# EAGLE design BT AQ DOL R9 (EAGLE 9.6.2)

## Sheet 1 of 2
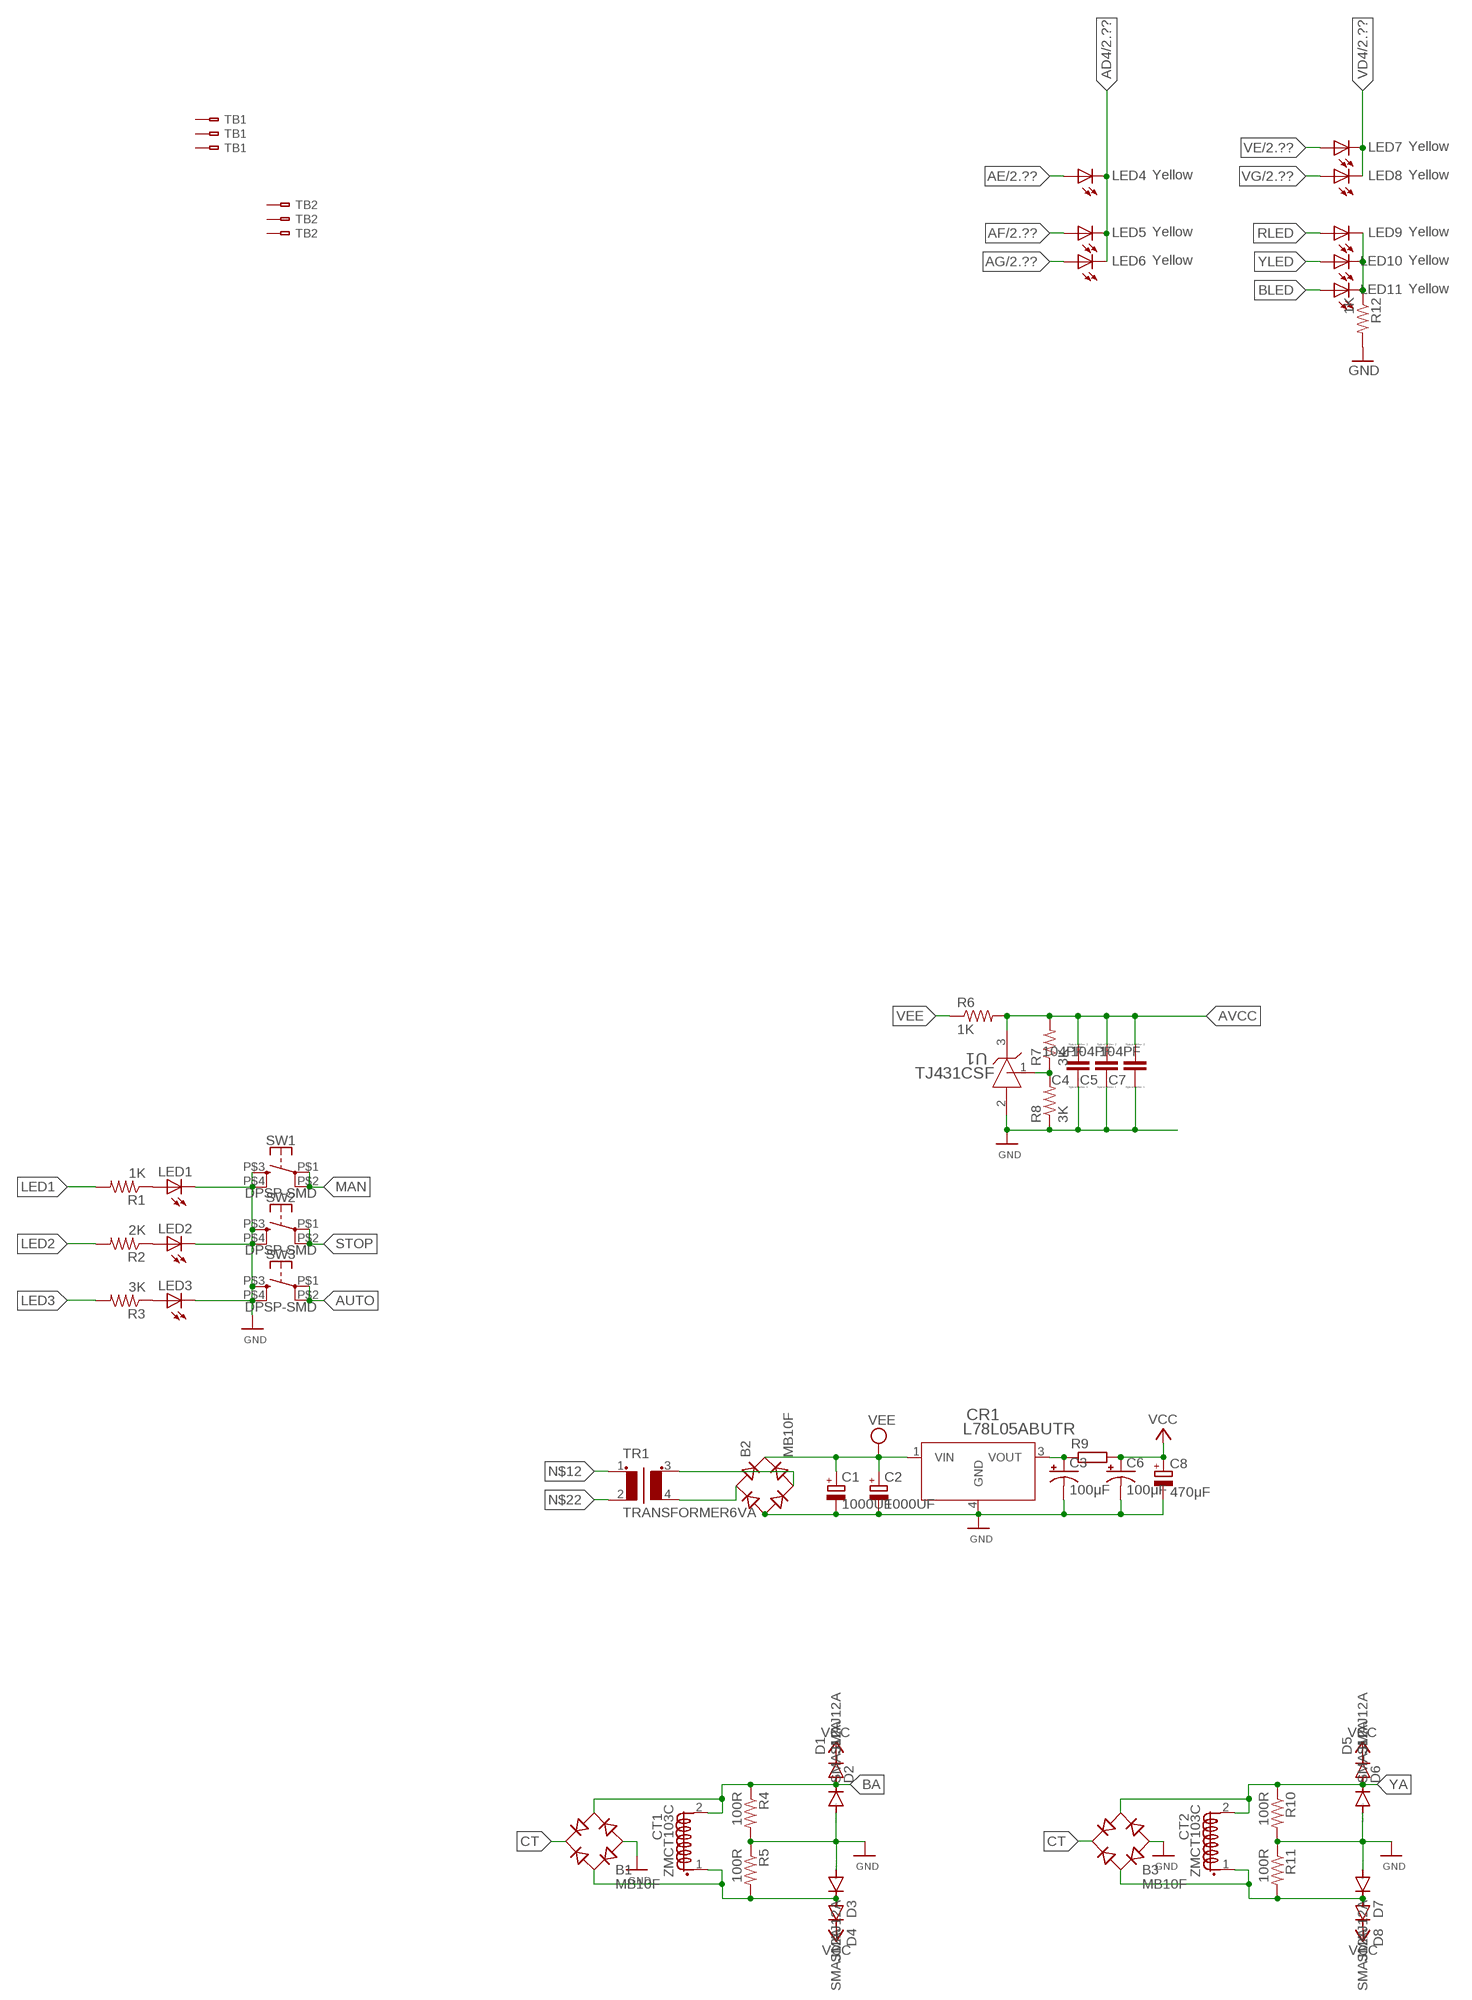
[diagram p0: schematic, sheet 1, part 1 of 3]
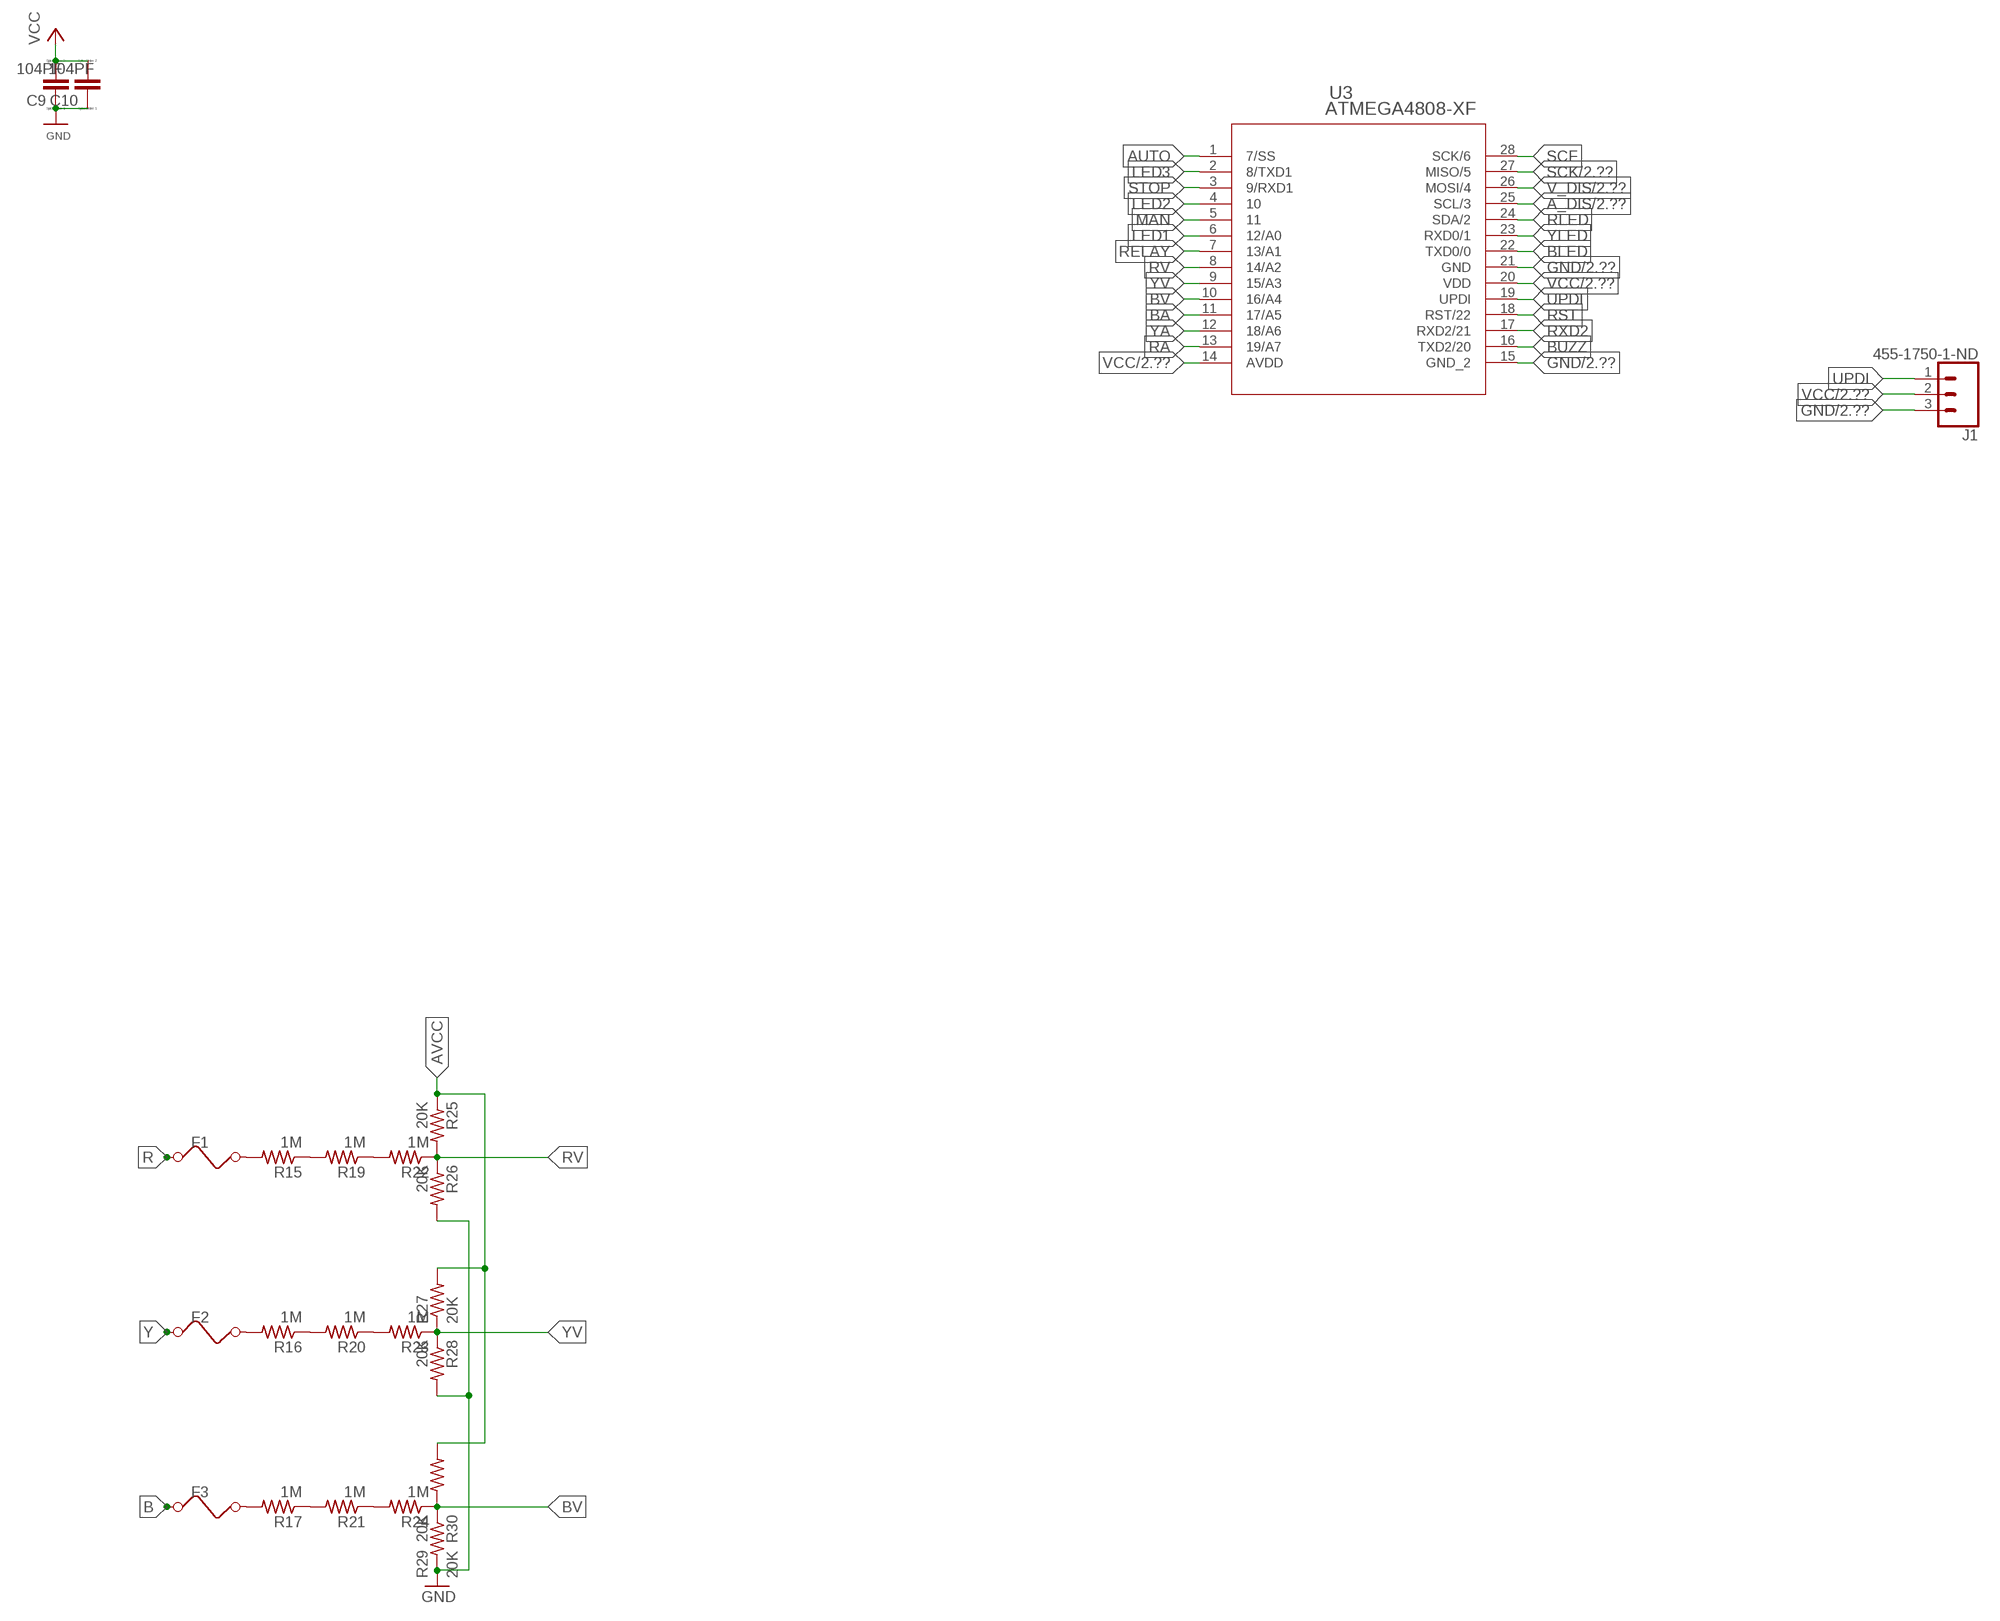
[diagram p1: schematic, sheet 1, part 2 of 3]
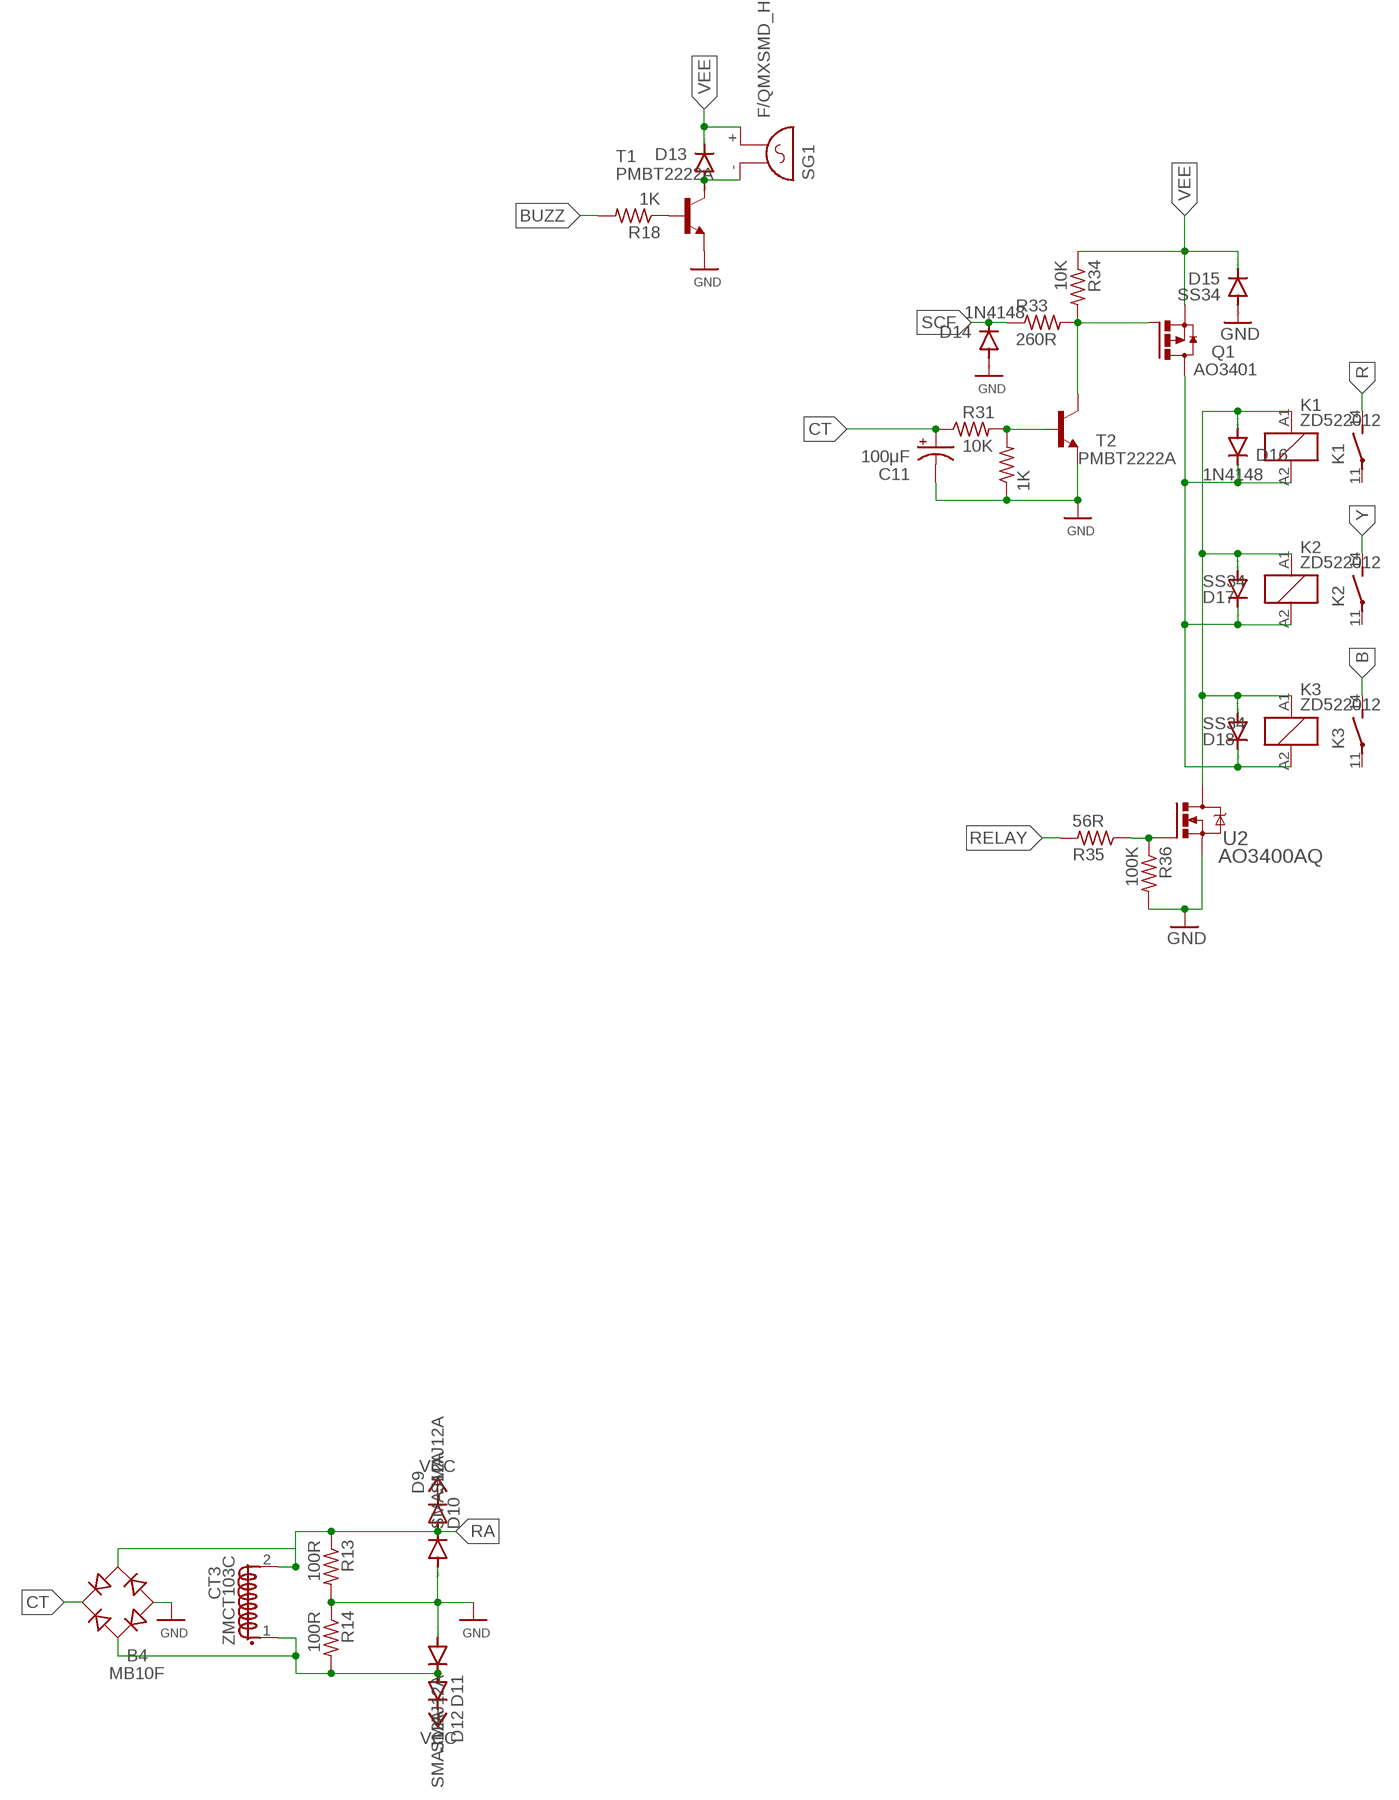
[diagram p2: schematic, sheet 1, part 3 of 3]

### Parts
B1  MB10F  MB8S  [SOIC-4]
B2  MB10F  MB8S  [SOIC-4]
B3  MB10F  MB8S  [SOIC-4]
B4  MB10F  MB8S  [SOIC-4]
C1  1000UF  CPOL-EUSANYO_G  [SANYO-OSCON_G]
C2  1000UF  CPOL-EUSANYO_G  [SANYO-OSCON_G]
C3  100μF  CPOL-USE2.5-6  [E2,5-6]
C4  104PF  CC1206  [C1206]
C5  104PF  CC1206  [C1206]
C6  100μF  CPOL-USE2.5-6  [E2,5-6]
C7  104PF  CC1206  [C1206]
C8  470μF  CPOL-EUE3.5-8  [E3,5-8]
C9  104PF  CC1206  [C1206]
C10  104PF  CC1206  [C1206]
C11  100μF  CPOL-USE2.5-6  [E2,5-6]
CR1  L78L05ABUTR  [D2PAK]
CT1  ZMCT103C  CT18X10  [ZMCT103C]
CT2  ZMCT103C  CT18X10  [ZMCT103C]
CT3  ZMCT103C  CT18X10  [ZMCT103C]
D1  SMAJ12A  DIODE-DO214AC  [DO214AC]
D2  SMAJ12A  DIODE-DO214AC  [DO214AC]
D3  SMAJ12A  DIODE-DO214AC  [DO214AC]
D4  SMAJ12A  DIODE-DO214AC  [DO214AC]
D5  SMAJ12A  DIODE-DO214AC  [DO214AC]
D6  SMAJ12A  DIODE-DO214AC  [DO214AC]
D7  SMAJ12A  DIODE-DO214AC  [DO214AC]
D8  SMAJ12A  DIODE-DO214AC  [DO214AC]
D9  SMAJ12A  DIODE-DO214AC  [DO214AC]
D10  SMAJ12A  DIODE-DO214AC  [DO214AC]
D11  SMAJ12A  DIODE-DO214AC  [DO214AC]
D12  SMAJ12A  DIODE-DO214AC  [DO214AC]
D13  1N4148  DIODE-MINIMELF  [MINIMELF]
D14  1N4148  DIODE-MINIMELF  [MINIMELF]
D15  SS34  DIODE-DO214AC  [DO214AC]
D16  1N4148  DIODE-MINIMELF  [MINIMELF]
D17  SS34  DIODE-DO214AC  [DO214AC]
D18  SS34  DIODE-DO214AC  [DO214AC]
F1  FUSESMD  [WIRE]
F2  FUSESMD  [WIRE]
F3  FUSESMD  [WIRE]
J1  455-1750-1-ND  CONN_03  [1X03]
K1  ZD522012  [ZD2F]
K2  ZD522012  [ZD2F]
K3  ZD522012  [ZD2F]
LED1  Blue  LED3MM  [LED3MM]
LED2  Blue  LED3MM  [LED3MM]
LED3  Blue  LED3MM  [LED3MM]
LED4  Yellow  LED3MM  [LED3MM]
LED5  Yellow  LED3MM  [LED3MM]
LED6  Yellow  LED3MM  [LED3MM]
LED7  Yellow  LED3MM  [LED3MM]
LED8  Yellow  LED3MM  [LED3MM]
LED9  Yellow  LED3MM  [LED3MM]
LED10  Yellow  LED3MM  [LED3MM]
LED11  Yellow  LED3MM  [LED3MM]
Q1  AO3401  FDN360P  [SUPER-SOT3]
R1  1K  R-US_M1206  [M1206]
R2  2K  R-US_M1206  [M1206]
R3  3K  R-US_M1206  [M1206]
R4  100R  R-US_M1206  [M1206]
R5  100R  R-US_M1206  [M1206]
R6  1K  R-US_M1206  [M1206]
R7  3K  R-US_M1206  [M1206]
R8  3K  R-US_M1206  [M1206]
R9  R-EU_R0603  [R0603]
R10  100R  R-US_M1206  [M1206]
R11  100R  R-US_M1206  [M1206]
R12  1K  R-US_M1206  [M1206]
R13  100R  R-US_M1206  [M1206]
R14  100R  R-US_M1206  [M1206]
R15  1M  R-US_M1206  [M1206]
R16  1M  R-US_M1206  [M1206]
R17  1M  R-US_M1206  [M1206]
R18  1K  R-US_M1206  [M1206]
R19  1M  R-US_M1206  [M1206]
R20  1M  R-US_M1206  [M1206]
R21  1M  R-US_M1206  [M1206]
R22  1M  R-US_M1206  [M1206]
R23  1M  R-US_M1206  [M1206]
R24  1M  R-US_M1206  [M1206]
R25  20K  R-US_M1206  [M1206]
R26  20K  R-US_M1206  [M1206]
R27  20K  R-US_M1206  [M1206]
R28  20K  R-US_M1206  [M1206]
R29  20K  R-US_M1206  [M1206]
R30  20K  R-US_M1206  [M1206]
R31  10K  R-US_M1206  [M1206]
R32  1K  R-US_M1206  [M1206]
R33  260R  R-US_M1206  [M1206]
R34  10K  R-US_M1206  [M1206]
R35  56R  R-US_M1206  [M1206]
R36  100K  R-US_M1206  [M1206]
SG1  F/QMXSMD_H  [F/QMX_H]
SW1  DPSP-SMD  [B3F-40XX-ROUND-SMD]
SW2  DPSP-SMD  [B3F-40XX-ROUND-SMD]
SW3  DPSP-SMD  [B3F-40XX-ROUND-SMD]
T1  PMBT2222A  MMUN2213LT1-NPN-SC59-BEC  [SC59-BEC]
T2  PMBT2222A  MMUN2213LT1-NPN-SC59-BEC  [SC59-BEC]
TB1  TERMINAL_BLOCK_3950/3  [950/3]
TB2  TERMINAL_BLOCK_3950/3  [950/3]
TR1  TRANSFORMER6VA  [440V12V6VA]
U1  TJ431CSF  TJ431CSFDBZ0003A_L  [SOT-23]
U2  AO3400AQ  [SOT-23-3L_AOS]
U3  ATMEGA4808-XF  [SSOP28_SS_MCH]

### Nets
A_DIS: U3.25(SCL/3) ; also sheet 2
AD4: LED4.K(C) LED5.K(C) LED6.K(C) ; also sheet 2
AE: LED4.A ; also sheet 2
AF: LED5.A ; also sheet 2
AG: LED6.A ; also sheet 2
AUTO: SW3.P$1 SW3.P$2 U3.1(7/SS)
AVCC: C4.2 C5.2 C7.2 R6.2 R7.2 R25.1 R27.2 R29.2 U1.3(CATHODE)
B: F3.1 K3.14(2:S)
BA: B1.~2(AC2) CT1.2(S1.2) D1.A D2.C R4.1 U3.11(17/A5)
BLED: LED11.A U3.22(TXD0/0)
BUZZ: R18.2 U3.16(TXD2/20)
BV: R24.1 R29.1 R30.1 U3.10(16/A4)
CT: B1.+ B3.+ B4.+ C11.+ R31.1
GND: B1.- B2.- B3.- B4.- C1.- C2.- C3.- C4.1 C5.1 C6.- C7.1 C8.- C9.1 C10.1 C11.- CR1.4(GND) D2.A D3.A D6.A D7.A D10.A D11.A D14.A D15.A J1.3 LED1.K(C) LED2.K(C) LED3.K(C) R4.2 R5.1 R8.1 R10.2 R11.1 R12.2 R13.2 R14.1 R26.2 R28.2 R30.2 R32.1 R36.2 SW1.P$3 SW1.P$4 SW2.P$3 SW2.P$4 SW3.P$3 SW3.P$4 T1.E T2.E U1.2(ANODE) U2.S U3.15(GND_2) U3.21(GND) ; also sheet 2
LED1: R1.2 U3.6(12/A0)
LED2: R2.2 U3.4
LED3: R3.2 U3.2(8/TXD1)
MAN: SW1.P$1 SW1.P$2 U3.5
N$1: R19.1 R22.2
N$2 [VEE]: B2.~1(AC1) TR1.4(S2)
N$3: D13.A SG1.- T1.C
N$4: R18.1 T1.B
N$5: R21.1 R24.2
N$6: R35.1 R36.1 U2.G
N$8: C3.+ CR1.3(VOUT) R9.1
N$9: LED3.A R3.1
N$10 [VEE]: B2.~2(AC2) TR1.3(S1)
N$11: R15.1 R19.2
N$12: F1.2 R15.2 TR1.1
N$13: LED2.A R2.1
N$14: R16.1 R20.2
N$15: R17.1 R21.2
N$17 [VEE]: D16.A D17.A D18.A K1.A1 K2.A1 K3.A1 U2.D
N$18: Q1.1(G) R33.2 R34.2 T2.C
N$19: R20.1 R23.2
N$20 [VEE]: D16.C D17.C D18.C K1.A2 K2.A2 K3.A2 Q1.3(D)
N$21: R7.1 R8.2 U1.1(REF)
N$22: F2.2 R16.2 TR1.2
N$23: B1.~1(AC1) CT1.1(S1.1) D3.C D4.A R5.2
N$24: F3.2 R17.2
N$25: R31.2 R32.2 T2.B
N$26: LED9.K(C) LED10.K(C) LED11.K(C) R12.1
N$33: LED1.A R1.1
N$47: B3.~1(AC1) CT2.1(S1.1) D7.C D8.A R11.2
N$62: B4.~1(AC1) CT3.1(S1.1) D11.C D12.A R14.2
R: F1.1 K1.14(2:S)
RA: B4.~2(AC2) CT3.2(S1.2) D9.A D10.C R13.1 U3.13(19/A7)
RELAY: R35.2 U3.7(13/A1)
RLED: LED9.A U3.24(SDA/2)
RST: U3.18(RST/22)
RV: R22.1 R25.2 R26.1 U3.8(14/A2)
RXD2: U3.17(RXD2/21)
SCF: D14.C R33.1 U3.28(SCK/6)
SCK: U3.27(MISO/5) ; also sheet 2
STOP: SW2.P$1 SW2.P$2 U3.3(9/RXD1)
UPDI: J1.1 U3.19(UPDI)
V_DIS: U3.26(MOSI/4) ; also sheet 2
VCC: C6.+ C8.+ C9.2 C10.2 D1.C D4.C D5.C D8.C D9.C D12.C J1.2 R9.2 U3.14(AVDD) U3.20(VDD) ; also sheet 2
VD4: LED7.K(C) LED8.K(C) ; also sheet 2
VE: LED7.A ; also sheet 2
VEE [VEE]: B2.+ C1.+ C2.+ CR1.1(VIN) D13.C D15.C Q1.2(S) R6.1 R34.1 SG1.+
VG: LED8.A ; also sheet 2
Y: F2.1 K2.14(2:S)
YA: B3.~2(AC2) CT2.2(S1.2) D5.A D6.C R10.1 U3.12(18/A6)
YLED: LED10.A U3.23(RXD0/1)
YV: R23.1 R27.1 R28.1 U3.9(15/A3)
Unconnected: K1.11(2:P) K2.11(2:P) K3.11(2:P) TB1.1@1(A1) TB1.1@2(A2) TB1.1@3(A3) TB2.1@1(A1) TB2.1@2(A2) TB2.1@3(A3)

## Sheet 2 of 2
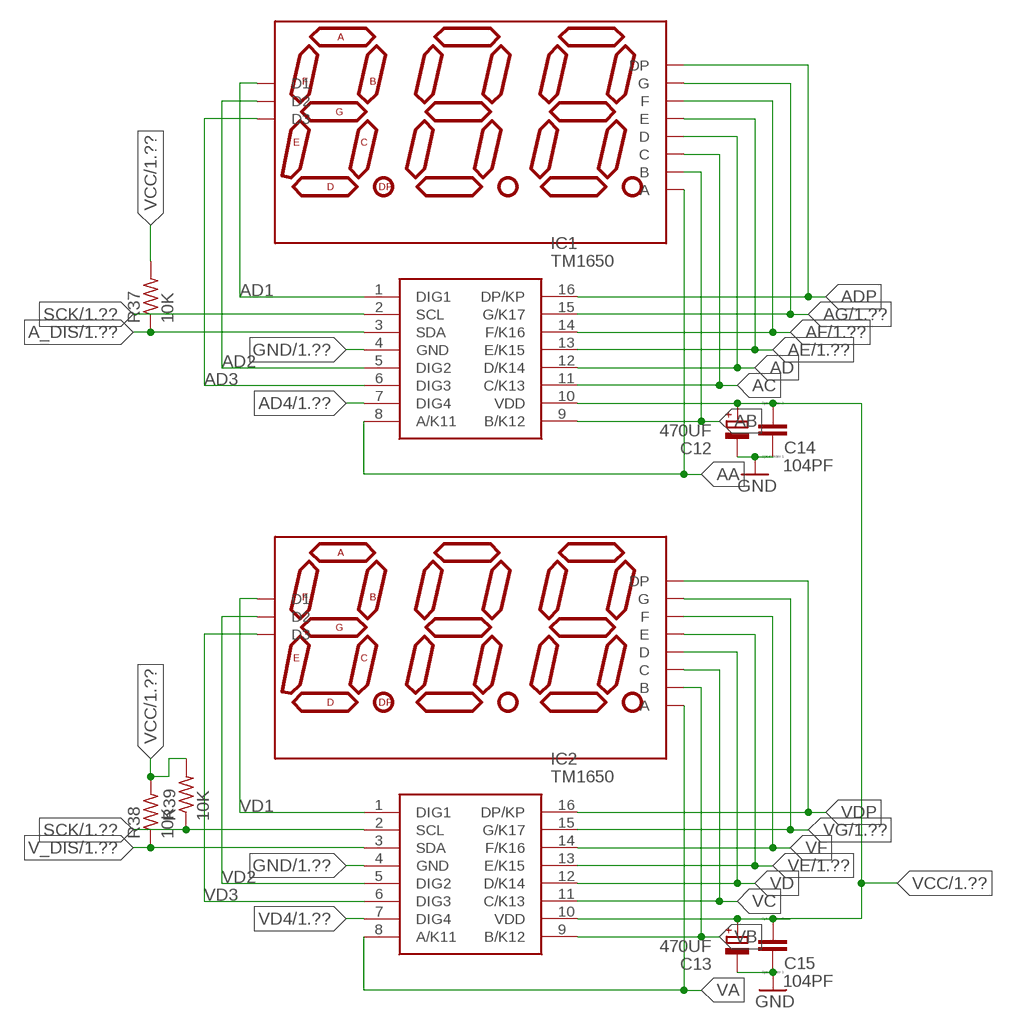
[diagram p3: schematic, sheet 2]

### Parts
C12  470UF  CPOL-EUE3.5-8  [E3,5-8]
C13  470UF  CPOL-EUE3.5-8  [E3,5-8]
C14  104PF  CC1206  [C1206]
C15  104PF  CC1206  [C1206]
D19  SUNR036CC3D  7SEGMENT-3DIGITDIP  [7S3D036_DIP]
D20  SUNR036CC3D  7SEGMENT-3DIGITDIP  [7S3D036_DIP]
IC1  TM1650  [SOIC127P604X185-16N]
IC2  TM1650  [SOIC127P604X185-16N]
R37  10K  R-US_M1206  [M1206]
R38  10K  R-US_M1206  [M1206]
R39  10K  R-US_M1206  [M1206]

### Nets
A_DIS: IC1.3(SDA) R37.1 ; also sheet 1
AA: D19.11(A) IC1.8(A/K11)
AB: D19.7(B) IC1.9(B/K12)
AC: D19.4(C) IC1.11(C/K13)
AD: D19.2(D) IC1.12(D/K14)
AD1: D19.12(D1) IC1.1(DIG1)
AD2: D19.9(D2) IC1.5(DIG2)
AD3: D19.8(D3) IC1.6(DIG3)
AD4: IC1.7(DIG4) ; also sheet 1
ADP: D19.3(DP) IC1.16(DP/KP)
AE: D19.1(E) IC1.13(E/K15) ; also sheet 1
AF: D19.10(F) IC1.14(F/K16) ; also sheet 1
AG: D19.5(G) IC1.15(G/K17) ; also sheet 1
GND: C12.- C13.- C14.1 C15.1 IC1.4(GND) IC2.4(GND) ; also sheet 1
SCK: IC1.2(SCL) IC2.2(SCL) R39.1 ; also sheet 1
V_DIS: IC2.3(SDA) R38.1 ; also sheet 1
VA: D20.11(A) IC2.8(A/K11)
VB: D20.7(B) IC2.9(B/K12)
VC: D20.4(C) IC2.11(C/K13)
VCC: C12.+ C13.+ C14.2 C15.2 IC1.10(VDD) IC2.10(VDD) R37.2 R38.2 R39.2 ; also sheet 1
VD: D20.2(D) IC2.12(D/K14)
VD1: D20.12(D1) IC2.1(DIG1)
VD2: D20.9(D2) IC2.5(DIG2)
VD3: D20.8(D3) IC2.6(DIG3)
VD4: IC2.7(DIG4) ; also sheet 1
VDP: D20.3(DP) IC2.16(DP/KP)
VE: D20.1(E) IC2.13(E/K15) ; also sheet 1
VF: D20.10(F) IC2.14(F/K16)
VG: D20.5(G) IC2.15(G/K17) ; also sheet 1

## Library data of the parts
B1-B4 = rectifier:MB*S: Bridge Rectifier Source: http://www.fairchildsemi.com/ds/MB/MB6S.pdf
C1 C2 C8 C12 C13 = rcl:CPOL-EU: POLARIZED CAPACITOR, European symbol; SPICEPREFIX: C
C3 C6 C11 = rcl:CPOL-US: POLARIZED CAPACITOR, American symbol; SPICEPREFIX: C
C4 C5 C7 C9 C10 C14 C15 = eagle-ltspice:C: CAPACITOR, European symbol; SPICEMODEL: NONE; SPICEPREFIX: C
CR1 = User Components:L78L05ABUTR
CT1-CT3 = User Components:CT
D1-D18 = diode:DIODE-: DIODE
D19 D20 = User Components:7SEGMENT-3DIGIT
F1-F3 = User Components:FUSE: FUSE 5 x 20 mm
IC1 IC2 = User Components:TM1650: The TM1650 is a dedicated LED (LED display) drive control circuit with a keyboard scan interface. The MCU input and output control digital interface, data latch, LED driver, keyboard scan, brightness adjustment and other circuits are integrated inside. The TM1650's stable performance, reliable quality, and high immunity to interference make it suitable for long-term continuous operation in 24 hours Source: Datasheet <http://www.titanmec.com/index.php/en/product/download/id/540.html>; DESCRIPTION: The TM1650 is a dedicated LED (LED display) drive control circuit with a keyboard scan interface. The MCU input and output control digital interface, data latch, LED driver, keyboard scan, brightness adjustment and other circuits are integrated inside. The TM1650's stable performance, reliable quality, and high immunity to interference make it suitable for long-term continuous operation in 24 hours; HEIGHT: 1.85mm; MANUFACTURER_NAME: TITAN MICRO ELECTRONICS; MANUFACTURER_PART_NUMBER: tm1650
J1 = SparkFun-Connectors:CONN_03: Multi connection point. Often used as Generic Header-pin footprint for 0.1 inch spaced/style header connections On any of the 0.1 inch spaced packages, you can populate with these: Break Away Headers - Straight <https://www.sparkfun.com/products/116> (PRT-00116) Break Away Male Headers - Right Angle <https://www.sparkfun.com/products/553> (PRT-00553) Female Headers <https://www.sparkfun.com/products/115> (PRT-00115) Break Away Headers - Machine Pin <https://www.sparkfun.com/products/117> (PRT-00117) Break Away Female Headers - Swiss Machine Pin <https://www.sparkfun.com/products/743> (PRT-00743) Stackable Header - 3 Pin (Female, 0.1") <https://www.sparkfun.com/products/13875> (PRT-13875) For SCREWTERMINALS and SPRING TERMINALS visit here: Screw Terimnals on SparkFun.com <https://www.sparkfun.com/search/results?term=Screw+Terminals> (5mm/3.5mm/2.54mm spacing) This device is also useful as a general connection point to wire up your design to another part of your project. Our various solder wires solder well into these plated through hole pads. Hook-Up Wire - Assortment (Stranded, 22 AWG) <https://www.sparkfun.com/products/11375> (PRT-11375) Hook-Up Wire - Assortment (Solid Core, 22 AWG) <https://www.sparkfun.com/products/11367> (PRT-11367) View the entire wire category on our website here <https://www.sparkfun.com/categories/141> Special notes: Molex polarized connector foot print use with SKU : PRT-08232 with associated crimp pins and housings.; PROD_ID: XXX-00000
K1-K3 = relay:ZD?2*: Power Relay SCHRACK 1 pole 30 A Source: http://www.schrack.com/.. 5848.pdf; OC_FARNELL: unknown; OC_NEWARK: unknown
LED1-LED11 = adafruit:LED: LED OSRAM: - CHIPLED LG R971, LG N971, LY N971, LG Q971, LY Q971, LO R971, LY R971 LH N974, LH R974 LS Q976, LO Q976, LY Q976 LO Q996 - Hyper CHIPLED LW Q18S LB Q993, LB Q99A, LB R99A - SideLED LS A670, LO A670, LY A670, LG A670, LP A670 LB A673, LV A673, LT A673, LW A673 LH A674 LY A675 LS A676, LA A676, LO A676, LY A676, LW A676 LS A679, LY A679, LG A679 - Hyper Micro SIDELED® LS Y876, LA Y876, LO Y876, LY Y876 LT Y87S - SmartLED LW L88C, LW L88S LB L89C, LB L89S, LG L890 LS L89K, LO L89K, LY L89K LS L896, LA L896, LO L896, LY L896 - TOPLED LS T670, LO T670, LY T670, LG T670, LP T670 LSG T670, LSP T670, LSY T670, LOP T670, LYG T670 LG T671, LOG T671, LSG T671 LB T673, LV T673, LT T673, LW T673 LH T674 LS T676, LA T676, LO T676, LY T676, LB T676, LH T676, LSB T676, LW T676 LB T67C, LV T67C, LT T67C, LS T67K, LO T67K, LY T67K, LW E67C LS E67B, LA E67B, LO E67B, LY E67B, LB E67C, LV E67C, LT E67C LW T67C LS T679, LY T679, LG T679 LS T770, LO T770, LY T770, LG T770, LP T770 LB T773, LV T773, LT T773, LW T773 LH T774 LS E675, LA E675, LY E675, LS T675 LS T776, LA T776, LO T776, LY T776, LB T776 LHGB T686 LT T68C, LB T68C - Hyper Mini TOPLED® LB M676 - Mini TOPLED Santana® LG M470 LS M47K, LO M47K, LY M47K Source: http://www.osram.convergy.de/
Q1 = transistor-power:FDN360P: Single P-Channel, PowerTrench (R) MOSFET Source: http://www.fairchildsemi.com/ds/FD/FDN360P.pdf
R1-R8 R10 R11 R13 R14 R31 R32 = rcl:R-US_: RESISTOR, American symbol
R9 = rcl:R-EU_: RESISTOR, European symbol; SPICEPREFIX: R
R12 R15-R30 R33-R39 = rcl:R-US_: RESISTOR, American symbol; SPICEPREFIX: R
SG1 = User Components:F/QMX: BUZZER Source: Buerklin
SW1-SW3 = User Components:DPSP-SMD
T1 T2 = transistor:*-NPN-: NPN Transistror BF959 corrected 2008.03.06
TB1 TB2 = User Components:TERMINAL_BLOCK_3
TR1 = User Components:TRANSFORMER
U1 = User Components:TJ431CSF; COPYRIGHT: Copyright (C) 2022 Ultra Librarian. All rights reserved.; MANUFACTURER_PART_NUMBER: TL431IDBZTG4; MFR_NAME: Texas Instruments; REFDES: RefDes; TYPE: TYPE
U2 = User Components:AO3400A; COPYRIGHT: Copyright (C) 2024 Ultra Librarian. All rights reserved.; MANUFACTURER_PART_NUMBER: AO3400A; MFR_NAME: Alpha and Omega Semiconductor
U3 = User Components:ATMEGA4808-XF; COPYRIGHT: Copyright (C) 2022 Ultra Librarian. All rights reserved.; MANUFACTURER_PART_NUMBER: ATMEGA4808-XF; MFR_NAME: Microchip

## Net classes
0 default: width 0.254 mm, drill 0.508 mm, clearance 0.508 mm
1 VEE: width 0.508 mm, drill 0.508 mm, clearance 0.762 mm

## Board
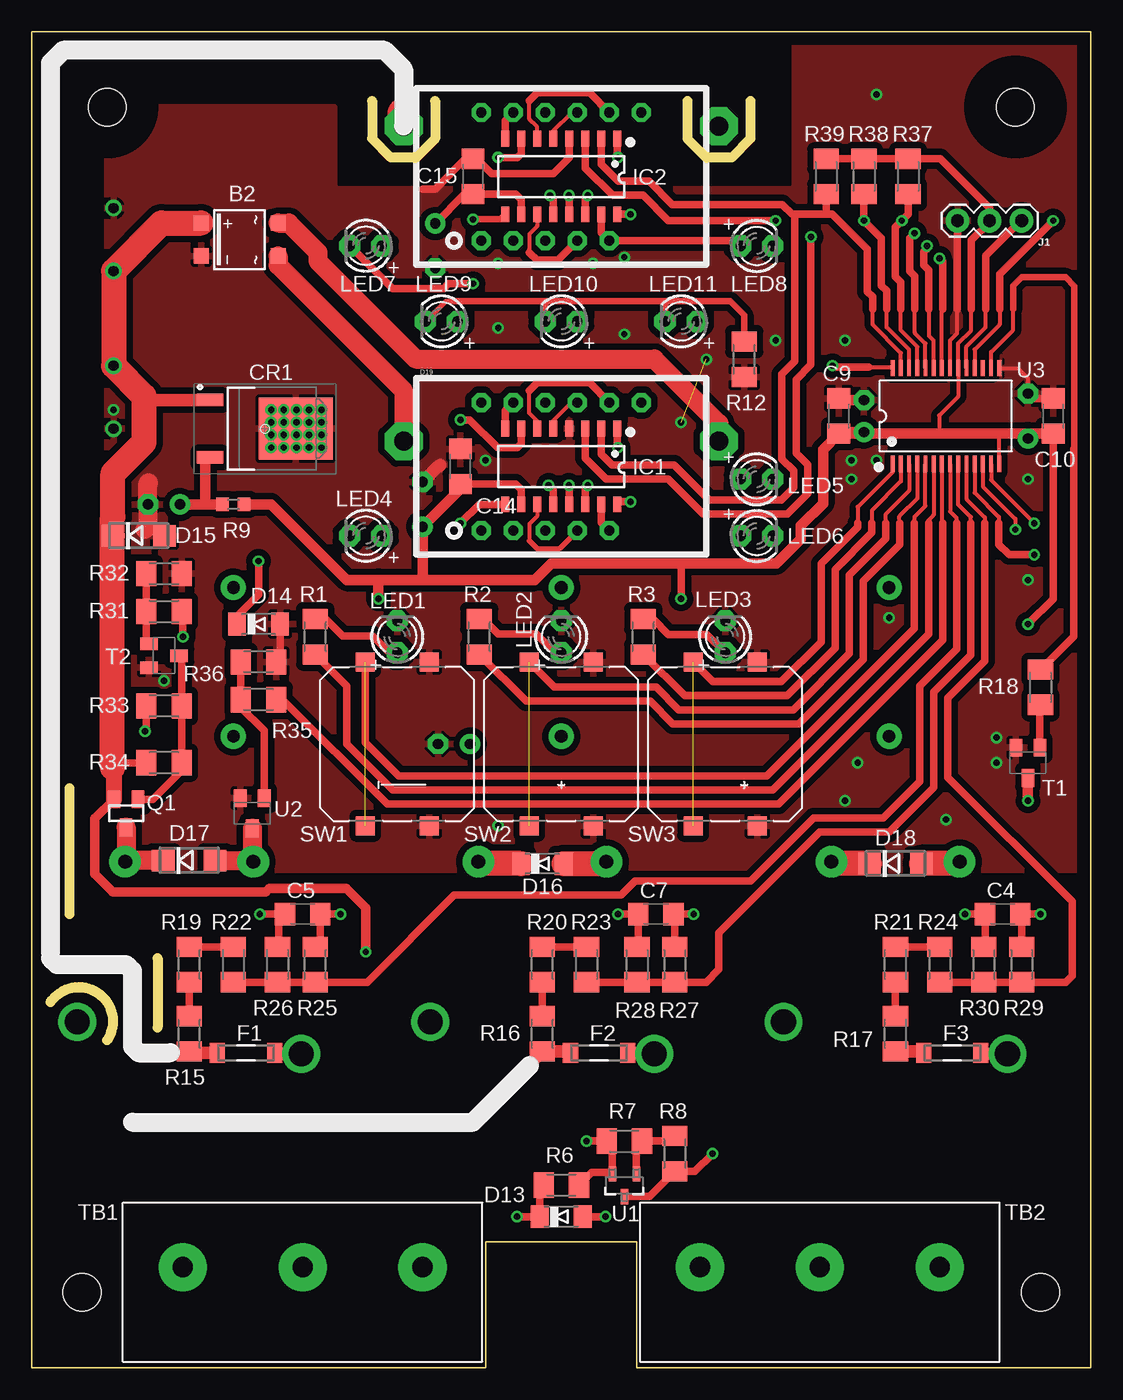
[diagram p4: board, top side]
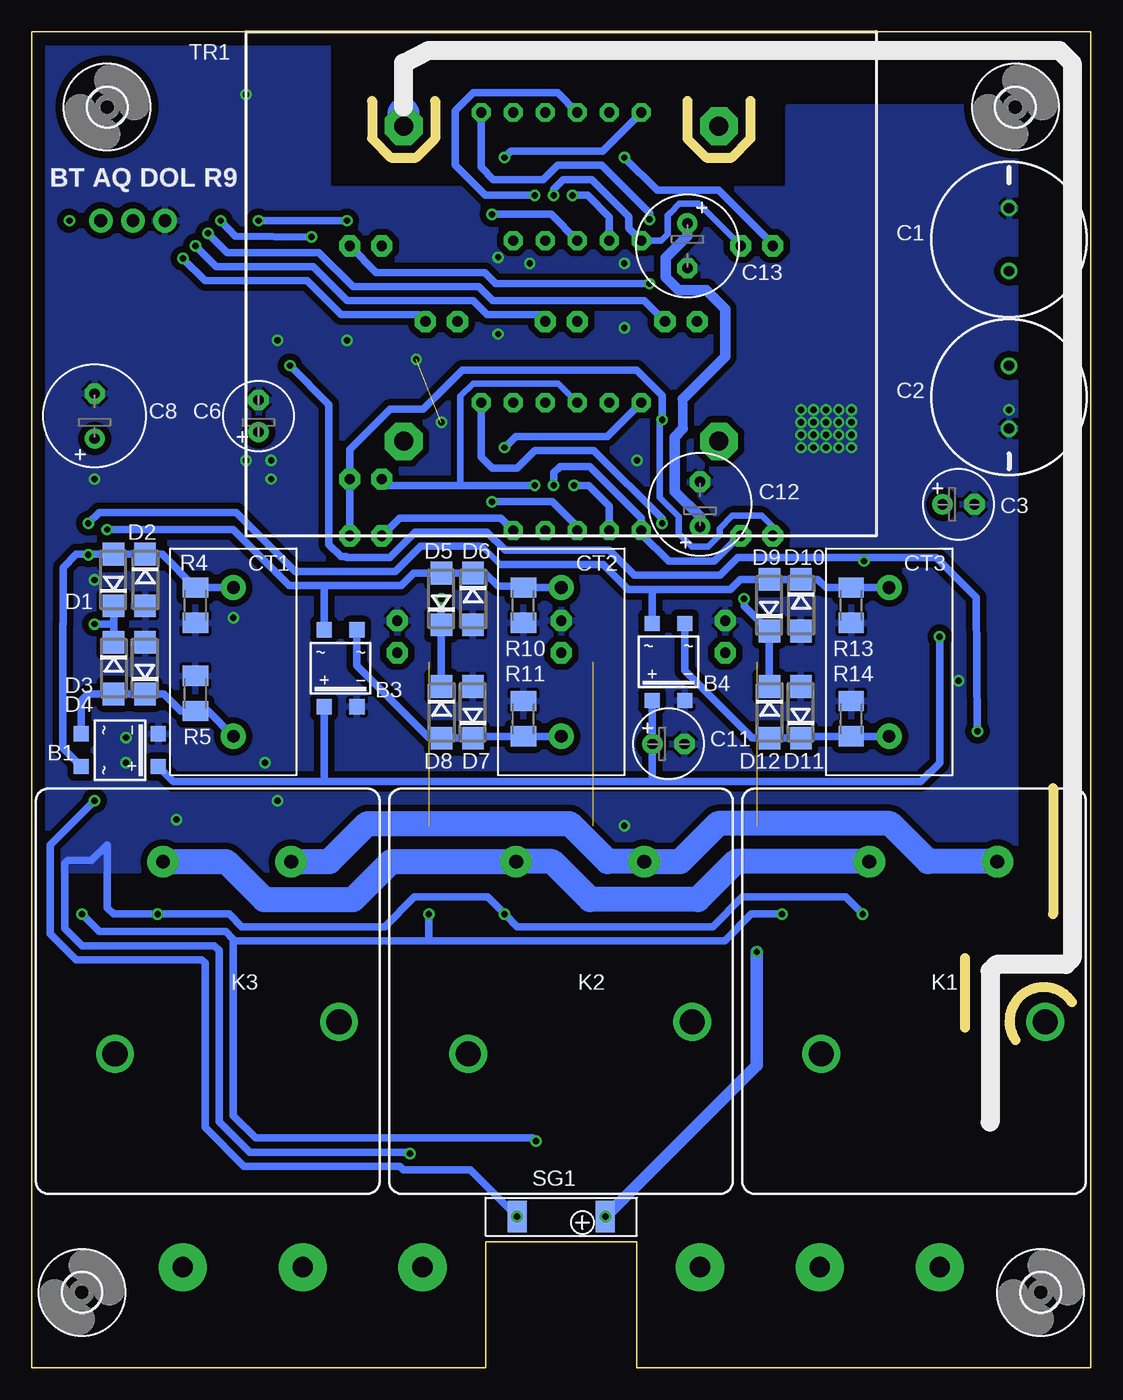
[diagram p5: board, bottom side, seen from below]

Size 84 x 106 mm. Coordinates in mm from the lower left corner, seen from the top.
Outline: 84,0 84,106 0,106 0,0 36,0 36,10 48,10 48,0 84,0
Copper layers (1*16): Top 0.035mm / dielectric 1.5mm / Bottom 0.035mm
Design rules "default *": minimum track width 6mil, minimum drill 0.35mm, track to track 6mil, track to pad 6mil, pad to pad 6mil, via to via 6mil, smd to smd 6mil, copper to edge 40mil, drill to drill 6mil, minimum pad ring 10mil, minimum via ring 8mil, stop-mask expansion 4mil, vias tented up to drill 20mil, thermal gap 10mil
Milling: 13 lines

### Footprints (pad centres in the part's own frame; a part is rotated, then mirrored left to right if it is on the bottom)
SOIC-4 = smd 1.2 x 1.2: + 1.3,3.05; - -1.3,3.05; ~1 -1.3,-3.05; ~2 1.3,-3.05
SANYO-OSCON_G = drill 0.8 pad 1.27: + 2.5,0; - -2.5,0
E2,5-6 = drill 0.813 pad 1.6: + -1.27,0 | drill 0.813 pad 1.6 octagon: - 1.27,0
C1206 = smd 1.6 x 1.8: 1 -1.4,0; 2 1.4,0
E3,5-8 = drill 0.813 pad 1.6: + -1.778,0 | drill 0.813 pad 1.6 octagon: - 1.778,0
D2PAK = smd 2.1 x 1: 1 -4.35,2.28; 3 -4.35,-2.28 | smd 5.85 x 4.9: 4 2.45,0
ZMCT103C = drill 1 pad 2: 1 -5.9,0; 2 5.9,0
DO214AC = smd 1.8 x 1.7: A 2.05,0; C -2.05,0
MINIMELF = smd 1.4 x 1.8: A 1.7,0; C -1.7,0
7S3D036_DIP = drill 0.8 pad 1.5 octagon: 1 -6.35,-5.08; 2 -3.81,-5.08; 3 -1.27,-5.08; 4 1.27,-5.08; 5 3.81,-5.08; 7 6.35,5.08; 8 3.81,5.08; 9 1.27,5.08; 10 -1.27,5.08; 11 -3.81,5.08; 12 -6.35,5.08
WIRE = smd 1.2 x 1.6: 1 -2.27,0; 2 2.27,0
SOIC127P604X185-16N = smd 1.25 x 0.65: 1 -3,4.445; 2 -3,3.175; 3 -3,1.905; 4 -3,0.635; 5 -3,-0.635; 6 -3,-1.905; 7 -3,-3.175; 8 -3,-4.445; 9 3,-4.445; 10 3,-3.175; 11 3,-1.905; 12 3,-0.635; 13 3,0.635; 14 3,1.905; 15 3,3.175; 16 3,4.445
1X03 = drill 1.016 pad 1.88: 1 0,0; 2 2.54,0; 3 5.08,0
ZD2F = drill 2 pad 2.5: 11 -2.54,-8.88; 14 -5.08,8.88 | drill 1.1 pad 2.5: A1 10.16,5.08; A2 10.16,-5.08
LED3MM = drill 0.813 pad 1.676 octagon: A -1.27,0; K 1.27,0
SUPER-SOT3 = smd 1 x 1.4: 1 -0.95,-1.1; 2 0.95,-1.1; 3 0,1.1
M1206 = smd 1.6 x 2: 1 -1.4,0; 2 1.4,0
R0603 = smd 1 x 1.1: 1 -0.85,0; 2 0.85,0
F/QMX_H = smd 1.5 x 2.5: + 3.5,1.5; - -3.5,1.5
B3F-40XX-ROUND-SMD = smd 1.5 x 1.5: P$1 -6.5,2.54; P$2 6.5,2.54; P$3 -6.5,-2.54; P$4 6.5,-2.54
SC59-BEC = smd 1 x 1.4: B -0.95,-1.2; C 0,1.2; E 0.95,-1.2
950/3 = drill 1.6 pad 3.81: 1@1 -9.5,0; 1@2 0,0; 1@3 9.5,0
440V12V6VA = drill 1.5 pad 3 octagon: 1 -12.5,12.5; 2 -12.5,-12.5; 3 12.5,-12.5; 4 12.5,12.5
SOT-23 = smd 0.6 x 1.2: 1 -0.95,-0.9; 2 0,0.9; 3 0.95,-0.9
SOT-23-3L_AOS = smd 1 x 1.4: D 0,1.2; G -0.95,-1.2; S 0.95,-1.2
SSOP28_SS_MCH = smd 1.3 x 0.3: 1 -3.8,4.225; 2 -3.8,3.575; 3 -3.8,2.925; 4 -3.8,2.275; 5 -3.8,1.625; 6 -3.8,0.975; 7 -3.8,0.325; 8 -3.8,-0.325; 9 -3.8,-0.975; 10 -3.8,-1.625; 11 -3.8,-2.275; 12 -3.8,-2.925; 13 -3.8,-3.575; 14 -3.8,-4.225; 15 3.8,-4.225; 16 3.8,-3.575; 17 3.8,-2.925; 18 3.8,-2.275; 19 3.8,-1.625; 20 3.8,-0.975; 21 3.8,-0.325; 22 3.8,0.325; 23 3.8,0.975; 24 3.8,1.625; 25 3.8,2.275; 26 3.8,2.925; 27 3.8,3.575; 28 3.8,4.225
3,0 = hole 3: 0,0

### Placement (x,y rotation side)
B1  77,49 270 bottom
B2  16.5,89.5 90 top
B3  59.5,55.5 180 bottom
B4  33.5,56 180 bottom
C1  6.5,89.5 270 bottom
C2  6.5,77 90 bottom
C3  10.5,68.5 0 bottom
C4  77,36 0 top
C5  21.5,36 0 top
C6  66,75.5 90 bottom
C7  49.5,36 0 top
C8  79,75.5 90 bottom
C9  64,75.5 270 top
C10  81,75.5 270 top
C11  33.5,49.5 0 bottom
C12  31,68.5 90 bottom
C13  32,89 270 bottom
C14  34,71.5 270 top
C15  35,94.5 270 top
CR1  18.5,74.5 0 top
CT1  68,56 90 bottom
CT2  42,56 90 bottom
CT3  16,56 90 bottom
D1  77.5,62.5 90 bottom
D2  75,62.5 270 bottom
D3  75,55.5 90 bottom
D4  77.5,55.5 270 bottom
D5  51.5,61 90 bottom
D6  49,61 270 bottom
D7  49,52 90 bottom
D8  51.5,52 270 bottom
D9  25.5,60.5 90 bottom
D10  23,60.5 270 bottom
D11  23,52 90 bottom
D12  25.5,52 270 bottom
D13  42,12 0 top
D14  18,59 0 top
D15  8.5,66 0 top
D16  40.5,40 0 top
D17  12.5,40.25 0 top
D18  68.5,40 0 top
D19  42,71.5 0 top
D20  42,94.5 0 top
F1  17,25 180 top
F2  45,25 180 top
F3  73,25 180 top
IC1  42,71.5 270 top
IC2  42,94.5 270 top
J1  78.5,91 180 top
K1  12.5,30 90 bottom
K2  40.5,30 90 bottom
K3  68.5,30 90 bottom
LED1  29,58 90 top
LED2  42,58 90 top
LED3  55,58 90 top
LED4  26.5,66 180 top
LED5  57.5,70.5 0 top
LED6  57.5,66 0 top
LED7  26.5,89 180 top
LED8  57.5,89 0 top
LED9  32.5,83 180 top
LED10  42,83 180 top
LED11  51.5,83 180 top
Q1  7.5,44 180 top
R1  22.5,58 270 top
R2  35.5,58 270 top
R3  48.5,58 270 top
R4  71,60.5 270 bottom
R5  71,53.5 270 bottom
R6  42,14.5 0 top
R7  47,18 180 top
R8  51,17 90 top
R9  16,68.5 0 top
R10  45,60.5 270 bottom
R11  45,51.5 270 bottom
R12  56.5,80 270 top
R13  19,60.5 270 bottom
R14  19,51.5 270 bottom
R15  12.5,26.5 270 top
R16  40.5,26.5 270 top
R17  68.5,26.5 270 top
R18  80,54 90 top
R19  12.5,32 270 top
R20  40.5,32 270 top
R21  68.5,32 270 top
R22  16,32 90 top
R23  44,32 90 top
R24  72,32 90 top
R25  22.5,32 270 top
R26  19.5,32 90 top
R27  51,32 90 top
R28  48,32 90 top
R29  78.5,32 90 top
R30  75.5,32 90 top
R31  10.5,60 180 top
R32  10.5,63 180 top
R33  10.5,52.5 0 top
R34  10.5,48 0 top
R35  18,53 0 top
R36  18,56 0 top
R37  69.5,94.5 90 top
R38  66,94.5 90 top
R39  63,94.5 90 top
SG1  42,10.5 0 bottom
SW1  29,49.5 90 top
SW2  42,49.5 90 top
SW3  55,49.5 90 top
T1  79,48 180 top
T2  10.5,56.5 270 top
TB1  21.5,8 0 top
TB2  62.5,8 0 top
TR1  42,86 270 bottom
U1  47,14.5 180 top
U2  17.5,44 180 top
U3  72.5,75.5 90 top
U$5  [3,0]  78,100 0 bottom
U$6  [3,0]  6,100 0 bottom
U$17  [3,0]  4,6 0 bottom
U$29  [3,0]  80,6 0 bottom

### Tracks (layer width: path | path; a pad name or v marks a point on that pad's centre or on a via)
A_DIS  (via drill 0.5)
  Top 0.305: U3.25 70.22,81 68.91,82.32 68.91,84
  Top 0.61: IC1.3 43.91,72.16 45.56,70.5 50.5,70.5 53.27,67.73 59.92,67.73 61.54,69.35 61.54,71.65 60.62,72.57 60.62,78.38 61.8,79.56 v61.8,89.7 | R37.1 69.5,91.5 v69,91 68.5,90.5 68.5,86.55 68.91,86.13 68.91,84
  Bottom 0.61: v69,91 67.83,89.75 v61.8,89.7
AA
  Top 0.61: IC1.8 37.55,75.94 D19.11
AB  (via drill 0.5)
  Top 0.61: v34,67 35.49,68.49 37.28,68.49 37.55,68.77 IC1.9
  Bottom 0.61: D19.7 48.35,72.23 47.47,71.36 45.5,71.36 44.09,72.77 39.41,72.77 34,67.35 v34,67
AC
  Top 0.305: IC1.11 40.09,67.56 39.47,66.94 39.47,65.64 39.46,65.62
  Top 0.406: 39.46,65.62 40.12,64.96 41.84,64.96 43.27,66.39 D19.4
AD  (via drill 0.5)
  Top 0.61: v41,70 41.37,69.64 IC1.12
  Bottom 0.61: D19.2 38.19,68.38 39.81,70 v41,70
AD1  (via drill 0.5)
  Top 0.61: v46.5,73 46.45,73.06 IC1.1
  Bottom 0.61: v46.5,73 45.62,73.88 38.35,73.88 D19.12
AD2
  Top 0.305: IC1.5 41.37,75.15 42.8,76.58 D19.9
AD3
  Top 0.305: IC1.6 40.09,75.11 39.46,75.75 39.46,77.52
  Top 0.61: 39.46,77.52 40.08,78.14 44.25,78.14 D19.8
AD4  (via drill 0.5)
  Top 0.61: IC1.7 38.83,73.33 38.5,73 36.96,73 34.76,75.2 v34,75.2
  Bottom 0.508: LED4.K 25.23,66.73 26.1,67.6 28.43,67.6 29.44,66.59 29.44,66.08 30.35,65.16 31.65,65.16 32.68,66.2 32.68,67.55 34.18,69.04 34.18,75.02 v34,75.2
  Bottom 0.61: LED6.K LED5.K 58.77,72.86 55.56,76.07 52.93,76.07 49.84,79.16 36.02,79.16 34,77.14 v34,75.2
ADP  (via drill 0.5)
  Top 0.61: v47.5,68.7 46.65,68.7 IC1.16
  Bottom 0.61: D19.3 40.73,66.73 42.73,68.73 45.5,68.71 47.49,68.71 v47.5,68.7
AE  (via drill 0.5)
  Top 0.61: IC1.13 42.63,69.86 v42.6,70
  Bottom 0.61: v42.6,70 42.6,71 42.1,71.5 39.73,71.5 35.65,67.42 D19.1 35.65,66.15 33.49,63.99 29.87,63.99 28.41,65.45 28.32,65.45 LED4.A
AF  (via drill 0.5)
  Top 0.61: IC1.14 43.91,69.91 v44.1,70
  Bottom 0.508: 50,70 50,77.07 48.98,78.09 42.24,78.09 D19.10
  Bottom 0.61: v44.1,70 50,70 55.73,70 LED5.A
AG
  Top 0.61: IC1.15 45.17,67.06 D19.5
  Bottom 0.61: D19.5 46.81,67.42 54.81,67.42 LED6.A
AUTO  (1 unrouted)
  Top 0.305: 65.5,67 65.5,68.3 68.28,71.07 U3.1
  Top 0.61: 65.5,67 65.5,66.7 62.6,63.8 62.6,57.58 59.45,54.44 54.02,54.44 SW3.P$2
AVCC  (via drill 0.5)
  Top 0.61: R25.1 22.9,33.8 C5.2 v24.5,36 | R27.2 51,35.9 C7.2 v52.5,36 | R6.2 44.4,15.5 45.95,15.5 U1.3 46.05,17.55 R7.2 v44,18 | R29.2 78.5,35.9 C4.2 v80,36
  Bottom 0.61: v80,36 78.63,34.61 68.61,34.61 68,34 | v24.5,36 26.92,36 29.04,33.88 52.5,33.88 | 68,34 68,20 66.23,18.23 54.56,18.23 54.53,18.27 44.27,18.27 v44,18 | 68,34 67.88,33.88 53,33.88 52.5,33.88 | v52.5,36 52.5,33.88
B
  Top 1: K3.14 75.35,24.92 F3.1
BA  (via drill 0.5)
  Top 0.305: 76.71,67 76.71,67.5 74.78,69.43 U3.11
  Top 0.61: 76.71,67 76.71,65.29 77.5,64.5 v79.5,64.5
  Bottom 0.61: CT1.2 R4.1 73.65,64.55 D2.C D1.A 79.45,64.55 | B1.~2 81.51,49.16 81.51,59 81.5,59.01 81.5,63.5 80.45,64.55 79.45,64.55 | 79.45,64.55 v79.5,64.5
BLED  (via drill 0.5)
  Top 0.305: U3.22 72.17,83.91 72.27,84
  Top 0.61: v72,88 72.27,87.73 72.27,84
  Bottom 0.61: v72,88 70.25,86.25 62.14,86.25 59.43,83.53 53.3,83.53 LED11.A
BUZZ
  Top 0.305: U3.16 76.08,80.58 77.83,82.33 77.83,84
  Top 0.508: 82.63,72.88 82.63,72.95 82.68,73 82.68,85.82 82,86.5 78.5,86.5 77.83,85.83 77.83,84
  Top 0.61: R18.2 82.63,58.03 82.63,72.88
BV
  Top 0.305: 75.59,67 75.59,67.46 74.12,68.93 U3.10
  Top 0.61: R24.1 R30.1 R29.1 82,30.6 82.5,31.1 82.5,37 72.66,46.84 72.66,53.16 75.59,56.09 75.59,67
CT  (via drill 0.5)
  Top 0.61: v12,58 12,59.9 R31.1
  Bottom 0.61: v12,58 12,48 13.5,46.5 35,46.5 | B1.+ 72.75,46.5 60.8,46.5 | 35,46.5 60.8,46.5 | B3.+ 60.8,46.5 | 35,46.5 34.77,46.73 C11.+ 34.8,49.53 B4.+
GND  (via drill 0.5)  (1 unrouted)
  Top 0.305: U3.15 78.2,79.3 79,78.5 C8.- | 73.38,84 73.38,82.08 72.83,81.52 U3.21
  Top 0.61: v18.1,36 C5.1 19.6,35.5 19.6,33.5 R26.2 | v46.5,36 C7.1 48.1,33.5 R28.2 | R30.2 75.6,33.5 C4.1 v74,36 | IC2.4 42.63,96 41.37,94.73 36.48,94.73 35.31,95.9 C15.1 34.4,95.9 32,93.5 31,93.5 | v54,17 52.6,15.6 R8.1 49,13.6 U1.2 | R36.2 19.7,56.3 D14.A | J1.3 73.42,89.93 73.38,89.9 73.38,84 | C8.- 79.38,76.9 C10.1
  Top 0.813: C6.- 64.13,76.77 C9.1
  Top 1: C12.- 32.22,71.5 32.27,71.5 32.39,71.61
  Top 1.5: 9,66.5 9.23,66.73 C3.- 9.23,70.18 9.28,70.22
  Bottom 0.61: v54,17 54.12,17.12 66.7,17.12 69.12,19.54 69.12,33.11 69.5,33.49 80,33.49 81.38,34.88 81.38,40 81.13,40.25 79.25,40.25 78,41.5 78,36.5 77.5,36 v74,36 68.34,36 67.34,35 56,35 53.66,37.34 47.84,37.34 v46.5,36 45.5,35 30,35 27.66,37.34 19.44,37.34 v18.1,36
  other vias: 19,76 19,75 19,74 19,73 20,73 20,74 20,75 20,76 21,76 21,75 21,74 21,73 22,73 22,74 22,75 22,76 36,72 76.5,48 76.5,50 65.5,48 64.5,45 23,73 23,74 23,75 23,76 37,43 6.5,76 67,101 64.5,81.5 37,82.5 72.5,43.5 51.5,75 10.5,54.5 47,82 68,59.5 79,62.5 79,70.5 47,88.1 44.5,87.6 67,72 65,70.5 65,72 53.5,80 59,81.5 37,87.6
  pour Bottom: 6,39.5 6,100 24,100 24,93.5 60.5,93.5 60.5,106 84,106 84,39.5
  pour Top: 6,39.5 6,100 24,100 24,93.5 60.5,93.5 60.5,106 84,106 84,39.5
LED1
  Top 0.305: 71.12,67 71.12,67.25 71.53,67.66 U3.6
  Top 0.61: R1.2 25,54.1 25,49.5 28.65,45.85 58.77,45.85 71.12,58.2 71.12,67
LED2
  Top 0.305: 68.85,67 68.81,67.56 70.22,68.97 U3.4
  Top 0.61: R2.2 39.22,52.88 49.06,52.88 50.85,51.08 60.84,51.08 65.95,56.19 65.95,62.41 68.85,65.32 68.85,67
LED3
  Top 0.305: 66.62,67 66.62,68.02 68.92,70.32 U3.2
  Top 0.61: R3.2 51.78,53.32 59.91,53.32 63.71,57.12 63.71,63.34 66.62,66.24 66.62,67
MAN  (1 unrouted)
  Top 0.305: 70,67 70,67.5 70.88,68.38 U3.5
  Top 0.61: SW1.P$2 26.46,49.62 29.11,46.97 58.31,46.97 70,58.66 70,67
N$1
  Top 0.61: R22.2 R19.1
N$2
  Top 1.5: TR1.4 29.5,77.5 19.55,87.45 B2.~1
N$3  (via drill 0.5)
  Top 0.61: D13.A SG1.-
  Top 0.813: T1.C v79,45
  Bottom 0.61: v79,45 82.5,41.5 82.5,34.42 80.46,32.38 70.5,32.38 70.23,32.11 70.23,19.07 67.16,16 54.8,16 54.53,15.73 49.23,15.73 SG1.-
  other vias: 45.5,12
N$4
  Top 0.61: T1.B 79.95,52.55 R18.1
N$5
  Top 0.61: R24.2 R21.1
N$6
  Top 0.61: R36.1 R35.1 16.6,52.4 18.45,50.55 U2.G
N$8
  Top 0.813: CR1.3 13.77,71.84 13.77,68.77 13.5,68.5 | C3.+ 13.5,68.5 | 13.5,68.5 R9.1
N$9
  Top 0.61: LED3.A 53.55,58.18 50.5,58.18 49.28,59.4 R3.1
N$10
  Top 1.5: TR1.3 54.5,74.91 49.37,80.03 30.46,80.03 22.7,87.79 22.7,88.5 20.4,90.8 B2.~2
N$11
  Top 0.61: R19.2 R15.1
N$12
  Top 0.61: 12.6,25 R15.2
  Top 1: 29.5,99.5 29.5,103 28,104.5 2.45,104.5 1.5,103.55 1.5,32.57 2.02,32.05 7.45,32.05 8,31.5 8,25.5 8.4,25.1 R15.2 | F1.2 12.6,25
  Top 2.54: TR1.1 29.5,99.5
N$13
  Top 0.61: LED2.A 41.5,56.73 40,58.23 37,58.23 35.83,59.4 R2.1
N$14
  Top 0.61: R16.1 R20.2
N$15
  Top 0.61: R17.1 R21.2
N$17
  Top 1.5: D17.A 17.49,40.25 | 17.49,40.25 K1.A1 | U2.D 17.5,40.26 17.49,40.25
  Top 2: D16.A 45.54,40 K2.A1 | K3.A1 73.54,40 D18.A
  Bottom 2: K1.A1 28.16,40.16 31.17,37.15 39.71,37.15 42.73,40.16 K2.A1 55.49,40.16 58.5,37.15 65.57,37.15 68.58,40.16 K3.A1
N$18
  Top 0.61: T2.C 11.9,56.3 R33.2 R34.2 11.9,47.4 9.6,45.1 Q1.1
N$19
  Top 0.61: R23.2 R20.1
N$20
  Top 1.5: Q1.3 7.5,40.24 | 7.5,40.24 K1.A2 | D17.C 7.51,40.25 7.5,40.24
  Top 2: D16.C 35.46,40 K2.A2 | D18.C 63.46,40 K3.A2
  Bottom 2: K1.A2 12.92,40.16 15.93,43.17 29.55,43.17 32.57,40.16 K2.A2 38.32,40.16 41.33,43.17 57.38,43.17 60.39,40.16 K3.A2
N$21
  Top 0.61: U1.1 47.95,17.55 R7.1 50.6,18 R8.2
N$22  (via drill 0.5)
  Top 1: v8,19.5 34.9,19.5 R16.2 42.63,25.1 F2.2
  Bottom 1: 54.5,99.5 54.5,103.43 52.62,104.5 2.45,104.5 1.5,103.55 1.5,32.5 2,32 7.5,32 8,31.5 v8,19.5
  Bottom 2.54: TR1.2 54.5,99.5
N$23
  Bottom 0.61: CT1.1 70,52.1 R5.2 72.15,52.1 73.5,53.45 D3.C D4.A 79.55,53.45 80.05,52.95 B1.~1
N$24
  Top 1: R17.2 70.63,25.1 F3.2
N$25
  Top 0.61: T2.B 9.1,57.65 R31.2 R32.2
N$26
  Top 0.406: 33.5,84.6 33.1,84.6 33.09,84.59 32.82,84.59 LED9.K
  Top 0.508: 33.5,84.6 40.5,84.6 | 40.5,84.6 50,84.6 | 50,84.6 55.4,84.6 56.5,83.5 R12.1 | LED11.K 50.23,84.37 50,84.6 | LED10.K 40.73,84.37 40.5,84.6
N$33
  Top 0.61: R1.1 23.33,59.4 24.67,58.06 27.05,58.06 28.38,56.73 LED1.A
N$47
  Bottom 0.61: CT2.1 R11.2 48.85,50.1 D7.C D8.A 52.45,49.95 58.2,55.7 B3.~1
N$62
  Bottom 0.61: CT3.1 R14.2 22.85,50.1 D11.C D12.A 26.85,49.95 32.2,55.3 B4.~1
R
  Top 1: K1.14 19.35,24.92 F1.1
RA  (via drill 0.5)
  Top 0.305: U3.13 76.08,70.42 v79.5,67
  Bottom 0.508: 48.5,65.19 48.29,65.19 46.85,63.74
  Bottom 0.61: CT3.2 R13.1 21,61.9 21.65,62.55 D10.C D9.A 27.79,62.55 28.58,61.76 34.8,61.76 | 48.5,65.19 53.13,65.19 55.15,63.17 63.09,63.17 67.77,67.85 78.65,67.85 v79.5,67 | 46.85,63.74 46.5,63.74 38.67,63.74 36.69,61.76 34.8,61.76 | B4.~2 34.8,61.76
RELAY
  Top 0.305: 72.23,67 72.17,67.06 U3.7
  Top 0.61: R35.2 19.92,53 28.18,44.73 59.23,44.73 72.23,57.74 72.23,67
RLED  (via drill 0.5)
  Top 0.305: U3.24 70.88,79.73 70.86,79.75 70.86,81.26 70.03,82.1 70.03,84
  Top 0.61: v70,90 69.61,89.61 69.61,87.01 70.03,86.59 70.03,84
  Bottom 0.61: v70,90 69.5,89.5 68.47,88.48 61.21,88.48 58.5,85.77 48.53,85.77 47.41,84.65 35.42,84.65 LED9.A
RST  (via drill 0.5)
  Top 0.305: 76.77,84 76.77,82.77 74.78,80.78 U3.18
  Top 0.61: v81,91 76.77,86.77 76.77,84
RV
  Top 0.305: 73.35,67 73.35,67.4 72.83,67.93 U3.8
  Top 0.61: R26.1 26.6,30.6 33.5,37.5 46.75,37.5 47.88,38.62 57.03,38.62 62.02,43.62 67.54,43.62 70.42,46.5 70.42,54.08 73.35,57.01 73.35,67 | R25.2 R26.1 | R26.1 R22.1
SCF  (via drill 0.5)
  Top 0.305: 66.38,79.38 68.2,79.38 U3.28
  Top 0.61: D14.C 16.3,59.64 18,61.34 v18,64 | R33.1 9.1,50.58 v9,50.5 | v63.5,79.5 63.62,79.38 66.38,79.38
  Bottom 0.61: v9,50.5 9.11,61.1 12.26,64.26 18,64.26 | 18,64.26 28.02,64.26 29.41,62.87 36.22,62.87 38.21,64.86 46.46,64.86 47.9,66.3 53.59,66.3 55.61,64.28 59,64.28 59.06,64.35 59.45,64.35 60.42,65.32 60.42,76.42 v63.5,79.5 | v18,64 18,64.26
SCK
  Top 0.305: 66.68,84 66.68,82.76 68.92,80.51 U3.27
  Top 0.61: IC2.2 45.17,95.47 46.53,94.12 48.96,94.12 50.81,92.27 59.53,92.27 60.3,91.5 | IC1.2 45.17,72.47 46.03,71.62 50.96,71.62 53.73,68.85 59.45,68.85 60.42,69.82 60.42,71.18 59.5,72.11 59.5,78.84 60.51,79.85 60.51,91.29 60.3,91.5 | 66.68,84 66.68,84.97 66.26,85.39 66.26,88.74 63.5,91.5 63,91.5 | R39.1 63,91.5 | 60.3,91.5 63,91.5
STOP  (1 unrouted)
  Top 0.305: 67.73,67 67.73,67.73 69.58,69.58 U3.3
  Top 0.61: SW2.P$2 41.46,54 49.52,54 51.32,52.2 60.38,52.2 64.83,56.66 64.83,62.88 67.73,65.78 67.73,67
UPDI
  Top 0.305: 75.65,84 75.65,82.55 74.12,81.02 U3.19
  Top 0.61: J1.1 78.44,91 75.65,88.21 75.65,84
V_DIS  (via drill 0.5)
  Top 0.305: 67.79,84 67.79,82.54 69.58,80.76 U3.26
  Top 0.61: IC2.3 43.91,95.16 46.06,93 48.5,93 50.5,91 v59,91 | R38.1 v66,91 67.38,89.62 67.38,85.85 67.79,85.43 67.79,84
  Bottom 0.61: v59,91 v66,91
VA
  Top 0.61: IC2.8 37.55,98.94 D20.11
VB  (via drill 0.5)
  Top 0.508: IC2.9 37.16,91.1 v35,91.1
  Bottom 0.61: D20.7 48.35,95.23 47.38,94.27 43.41,94.27 42.3,95.38 38.8,95.38 35,91.58 v35,91.1
VC
  Top 0.305: IC2.11 40.09,90.56 39.47,89.94 39.47,88.71 39.46,88.69 39.46,88.48
  Top 0.61: 39.46,88.48 40.08,87.86 41.71,87.86 D20.4
VCC  (via drill 0.5)
  Top 0.305: U3.14 76.72,73.83 77,74.1 | 72,74.1 71.96,74.14 71.96,75.54 73.47,77.06 U3.20 73.47,81.27 74.5,82.3 74.5,84
  Top 0.61: IC2.10 38.83,92.67 38.4,93.1 C15.2 34.32,93.1 C13.+ | C14.2 38.4,70.1 38.83,69.67 IC1.10 | v79,59 81,61 C10.2 | 74.5,84 74.5,89.43 75.96,90.89 J1.2 75.96,92 72.06,95.9 R37.2 R38.2 R39.2 | v51.5,61 51.5,63.81
  Top 0.813: 78.62,74.1 C10.2 | 27.5,62.5 25,62.5 19,68.5 R9.2 | 27.5,62.5 31,62.5 | 31,62.5 39.89,62.5 41.21,63.81 51.5,63.81 59.06,63.81 61,65.75 61,66.81 62.76,68.56 62.76,72.86 C9.2 | 27.5,62.5 v27.5,61 | C14.2 34,69.72 C12.+ 31,62.5 | C8.+ 78.62,74.1 | 78.62,74.1 77,74.1 72,74.1 C9.2 | C6.+ 64.13,74.23 C9.2
  Bottom 0.61: D12.C D9.C 27.5,60.45 v27.5,61 | D8.C D5.C v51.5,61 | D1.C 77.5,59 | 77.5,59 D4.C | v79,59 77.5,59
  Bottom 0.762: 32.36,76.86 32.36,74.5
  Bottom 0.813: 32.36,76.86 29,80.21 29,84 30.5,85.5 32.7,85.5 33.72,86.51 33.72,88.06 32,89.78 C13.+ | 32.36,74.5 33.01,73.85 33.01,69.53 31,67.52 C12.+
VD  (via drill 0.5)
  Top 0.61: IC2.12 41.37,92.73 v41.1,93
  Bottom 0.61: v41.1,93 39.91,93 38.19,91.28 D20.2
VD1  (via drill 0.5)
  Top 0.61: IC2.1 46.45,96.06 v46.5,96
  Bottom 0.61: D20.12 38.73,96.5 46,96.5 v46.5,96
VD2
  Top 0.305: IC2.5 41.37,98.11 42.83,99.58 D20.9
VD3
  Top 0.305: IC2.6 40.09,98.44 39.47,99.06 39.47,100.47 39.47,100.53
  Top 0.61: 39.47,100.53 40.08,101.14 44.25,101.14 D20.8
VD4  (via drill 0.5)
  Top 0.61: IC2.7 38.83,96.33 38.5,96 v37,96 | v35,86 33.06,86 32.67,85.61 28.62,85.61 LED7.K
  Bottom 0.61: v35,86 47.18,86 48.07,86.89 56.66,86.89 LED8.K | LED7.K 25.23,89.14 29.5,93.41 34.41,93.41 v37,96
VDP  (via drill 0.5)
  Top 0.61: v47.5,91.5 IC2.16
  Bottom 0.61: D20.3 42.81,91.5 v47.5,91.5
VE  (via drill 0.5)
  Top 0.61: IC2.13 42.63,92.86 v42.6,93
  Bottom 0.508: LED7.A 31.11,92.34 32.65,92.34 33.38,91.61 33.39,91.61 33.56,91.44 33.56,89.94 34.08,89.42 D20.1
  Bottom 0.61: D20.1 36.65,90.42 36.65,91.32 39.59,94.27 41.83,94.27 42.6,93.5 v42.6,93
VEE  (via drill 0.5)
  Top 0.61: SG1.+ D13.C 40.3,14.2 R6.1 | R34.1 6.4,48
  Top 0.762: v26.5,33 26.5,36.5 24.96,38.04 18.85,38.04 18.57,37.77 6.43,37.77 5.03,39.17 5.03,43.58 Q1.2
  Top 0.813: D15.C 6.4,66
  Top 1: CR1.1 9.22,76.78 8.92,77.08
  Top 1.27: Q1.2 6.55,47.45 6.4,47.6
  Top 2: B2.+ 10.3,90.8 C1.+ C2.+ 8.92,77.08 8.92,73.42 6.45,70.95 6.45,67.5 6.4,67.45 6.4,66 6.4,48 6.4,47.6
  Bottom 1: SG1.+ 26.5,24 v26.5,33
  other vias: 38.5,12
VF  (via drill 0.5)
  Top 0.61: IC2.14 43.91,92.91 v44.1,93
  Bottom 0.61: v44.1,93 48.02,93 50.41,95.39 50.41,99.73 49,101.14 42.29,101.14 D20.10
VG
  Top 0.61: IC2.15 45.17,90.06 D20.5 55.81,89.42 LED8.A
Y
  Top 1: F2.1 49.3,25 K2.14
YA  (via drill 0.5)
  Top 0.305: U3.12 75.42,69.93 78,67.35 v78,66.5
  Bottom 0.61: CT2.2 R10.1 45.1,62 47,62 48.05,63.05 D6.C D5.A 53.68,63.05 54.68,62.05 60.8,62.05 | v78,66.5 68,66.5 63.55,62.05 61,62.05 60.8,62.05 | B3.~2 60.8,62.05
YLED  (via drill 0.5)
  Top 0.305: U3.23 71.53,81.5 71.15,81.88 71.15,84
  Top 0.61: v71,89 71,88.8 70.73,88.53 70.73,87.47 71.15,87.06 71.15,84
  Bottom 0.61: v71,89 69.36,87.36 61.67,87.36 58.96,84.65 48.99,84.65 48.67,84.33 47.88,83.53 46,83.53 45.5,83.53 43.8,83.53 LED10.A
YV
  Top 0.305: U3.9 73.47,68.5 74.47,67.5 74.47,67
  Top 0.61: R23.1 R28.1 R27.1 53.5,30.6 54.5,31.6 54.5,34.52 62.46,42.48 62.48,42.48 62.5,42.5 68,42.5 71.54,46.04 71.54,53.62 74.47,56.55 74.47,67

### Text on the board
bNames: BT AQ DOL R9
Reference: BT AQ DOL R5